# Altium schematic sheet USB.SchDoc
size A
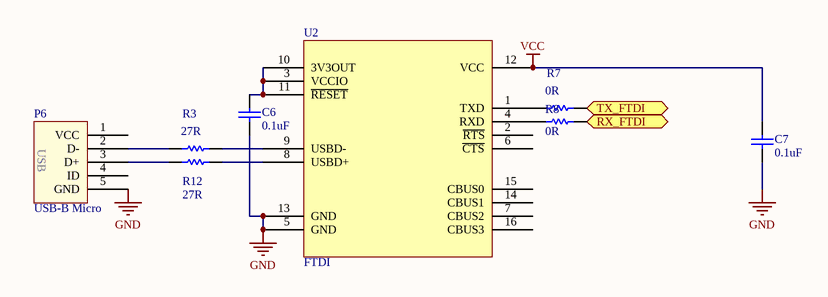
[diagram p0: USB.SchDoc]

## Parts
C6  value 0.1uF  [0805]  (hidden comment: Cap)
C7  value 0.1uF  [0805]  (hidden comment: Cap)
P6  USB-B Micro  [USB B Micro WM14338CT-ND]
R3  value 27R  [0805]  (hidden comment: Res1)
R7  value 0R  [0805]  (hidden comment: Res1)
R8  value 0R  [0805]  (hidden comment: Res1)
R12  value 27R  [0805]  (hidden comment: Res1)
U2  FTDI  [FTDI_SSOP_16]

## Ports
RX_FTDI, TX_FTDI

## Nets
GND: C6.1 C7.1 P6.5(GND) U2.5(GND) U2.13(GND)
VCC: C7.2 U2.12(VCC)
RX_FTDI: R8.1 ; port RX_FTDI
TX_FTDI: R7.2 ; port TX_FTDI
NetC6_2: C6.2 U2.3(VCCIO) U2.10(3V3OUT) U2.11(~{RESET})
NetP6_2: P6.2(D-) R3.1
NetP6_3: P6.3(D+) R12.1
NetR3_2: R3.2 U2.9(USBD-)
NetR7_1: R7.1 U2.1(TXD)
NetR8_2: R8.2 U2.4(RXD)
NetR12_2: R12.2 U2.8(USBD+)

Not connected (* = marked no-connect by the designer): P6 1(VCC) 4(ID); U2 2(~{RTS}) 6(~{CTS}) 7(CBUS2) 14(CBUS1) 15(CBUS0) 16(CBUS3)

## Notes on the sheet
- (in symbol USB-B Micro 4 Pad) USB

## Library data of the parts
C6 C7 = Capacitor: Chip Capacitor
P6 = USB-B Micro 4 Pad: USB-B SMT Connector; Manufacturer Part No.: 0476100001; Digi-Key Part No.: WM14338CT-ND
R3 R7 R8 R12 = Res1: Resistor; Published: 8-Jun-2000; LatestRevisionDate: 17-Jul-2002; LatestRevisionNote: Re-released for DXP Platform.; PackageReference: AXIAL-0.3; Publisher: Altium Limited; PackageDescription: Axial Device, Thru-Hole; 2 Leads; 0.3 in Pin Spacing
U2 = FTDI: USB-UART Converter; Manufacturer Part No.: FT230XS-U; Digi-Key Part No.: 768-1135-1-ND; ComponentLink1Description: Datasheet; ComponentLink1URL: http://www.ftdichip.com/Support/Documents/DataSheets/ICs/DS_FT230X.pdf